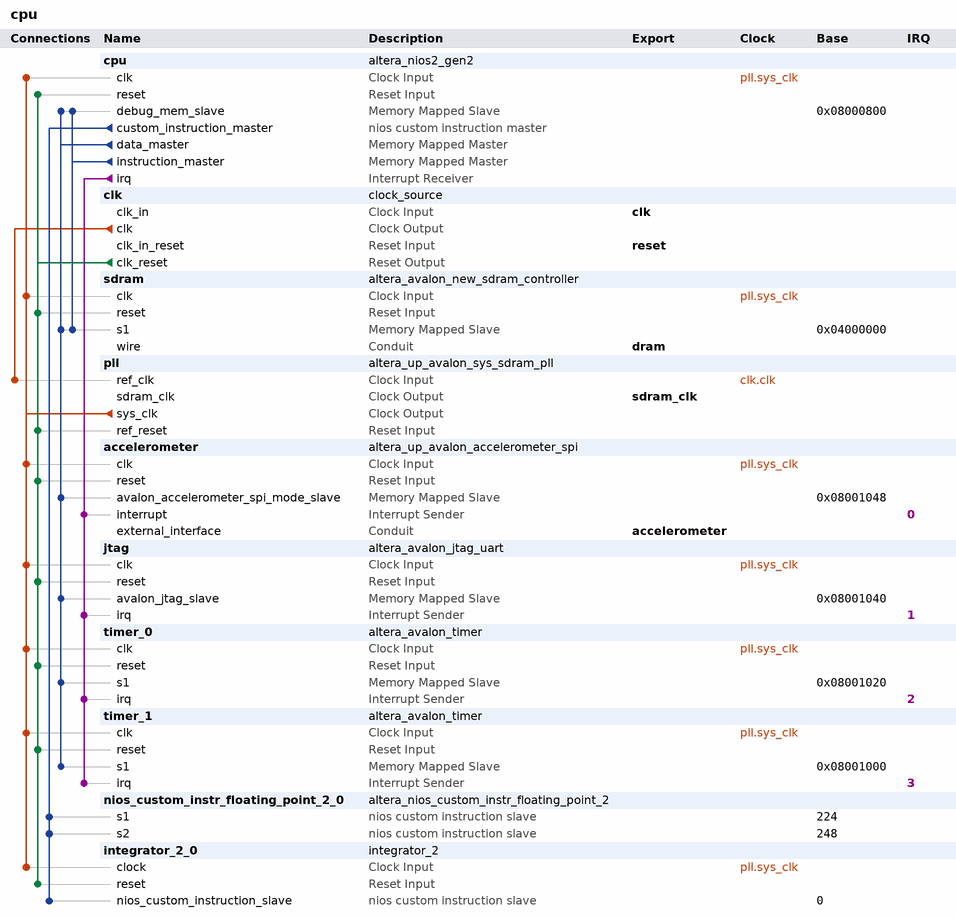
[diagram p0: system contents]
# Platform Designer (Qsys) system cpu, MAX 10 10M50DAF484C7G
# Parameters at their usual value, and those the tool derives, are not listed.
package require -exact qsys 20.1
create_system cpu
set_project_property DEVICE_FAMILY {MAX 10}
set_project_property DEVICE 10M50DAF484C7G

add_instance cpu altera_nios2_gen2 20.1
set_instance_parameter_value cpu dcache_size 2048
set_instance_parameter_value cpu exceptionSlave sdram.s1
set_instance_parameter_value cpu icache_size 4096
set_instance_parameter_value cpu impl Tiny
set_instance_parameter_value cpu resetSlave sdram.s1

add_instance clk clock_source 20.1
set_instance_parameter_value clk clockFrequency 50000000

add_instance sdram altera_avalon_new_sdram_controller 20.1
set_instance_parameter_value sdram TAC 5.5
set_instance_parameter_value sdram TRCD 20.0
set_instance_parameter_value sdram TRP 20.0
set_instance_parameter_value sdram casLatency 3
set_instance_parameter_value sdram columnWidth 10
set_instance_parameter_value sdram dataWidth 16
set_instance_parameter_value sdram generateSimulationModel false
set_instance_parameter_value sdram model single_Micron_MT48LC4M32B2_7_chip
set_instance_parameter_value sdram numberOfBanks 4
set_instance_parameter_value sdram numberOfChipSelects 1
set_instance_parameter_value sdram powerUpDelay 100.0
set_instance_parameter_value sdram refreshPeriod 15.625
set_instance_parameter_value sdram rowWidth 13

add_instance pll altera_up_avalon_sys_sdram_pll 18.0
set_instance_parameter_value pll CV_boards DE10-Standard
set_instance_parameter_value pll gui_outclk 50.0
set_instance_parameter_value pll gui_refclk 50.0

add_instance accelerometer altera_up_avalon_accelerometer_spi 18.0

add_instance jtag altera_avalon_jtag_uart 20.1
set_instance_parameter_value jtag simInteractiveOptions NO_INTERACTIVE_WINDOWS

add_instance timer_0 altera_avalon_timer 20.1
set_instance_parameter_value timer_0 period 1
set_instance_parameter_value timer_0 periodUnits MSEC

add_instance timer_1 altera_avalon_timer 20.1
set_instance_parameter_value timer_1 period 1
set_instance_parameter_value timer_1 periodUnits MSEC

add_instance nios_custom_instr_floating_point_2_0 altera_nios_custom_instr_floating_point_2 20.1
set_instance_parameter_value nios_custom_instr_floating_point_2_0 arithmetic_present true
set_instance_parameter_value nios_custom_instr_floating_point_2_0 comparison_present true
set_instance_parameter_value nios_custom_instr_floating_point_2_0 conversion_present true
set_instance_parameter_value nios_custom_instr_floating_point_2_0 root_present false

add_instance integrator_2_0 integrator_2 2.0

# connections
add_connection clk.clk pll.ref_clk clock
add_connection pll.sys_clk accelerometer.clk clock
add_connection pll.sys_clk cpu.clk clock
add_connection pll.sys_clk integrator_2_0.clock clock
add_connection pll.sys_clk jtag.clk clock
add_connection pll.sys_clk sdram.clk clock
add_connection pll.sys_clk timer_0.clk clock
add_connection pll.sys_clk timer_1.clk clock
add_connection clk.clk_reset accelerometer.reset reset
add_connection clk.clk_reset cpu.reset reset
add_connection clk.clk_reset integrator_2_0.reset reset
add_connection clk.clk_reset jtag.reset reset
add_connection clk.clk_reset pll.ref_reset reset
add_connection clk.clk_reset sdram.reset reset
add_connection clk.clk_reset timer_0.reset reset
add_connection clk.clk_reset timer_1.reset reset
add_connection cpu.data_master accelerometer.avalon_accelerometer_spi_mode_slave avalon
set_connection_parameter_value cpu.data_master/accelerometer.avalon_accelerometer_spi_mode_slave baseAddress 0x08001048
add_connection cpu.data_master cpu.debug_mem_slave avalon
set_connection_parameter_value cpu.data_master/cpu.debug_mem_slave baseAddress 0x08000800
add_connection cpu.data_master jtag.avalon_jtag_slave avalon
set_connection_parameter_value cpu.data_master/jtag.avalon_jtag_slave baseAddress 0x08001040
add_connection cpu.data_master sdram.s1 avalon
set_connection_parameter_value cpu.data_master/sdram.s1 baseAddress 0x04000000
add_connection cpu.data_master timer_0.s1 avalon
set_connection_parameter_value cpu.data_master/timer_0.s1 baseAddress 0x08001020
add_connection cpu.data_master timer_1.s1 avalon
set_connection_parameter_value cpu.data_master/timer_1.s1 baseAddress 0x08001000
add_connection cpu.instruction_master cpu.debug_mem_slave avalon
set_connection_parameter_value cpu.instruction_master/cpu.debug_mem_slave baseAddress 0x08000800
add_connection cpu.instruction_master sdram.s1 avalon
set_connection_parameter_value cpu.instruction_master/sdram.s1 baseAddress 0x04000000
add_connection cpu.irq accelerometer.interrupt interrupt
set_connection_parameter_value cpu.irq/accelerometer.interrupt irqNumber 0
add_connection cpu.irq jtag.irq interrupt
set_connection_parameter_value cpu.irq/jtag.irq irqNumber 1
add_connection cpu.irq timer_0.irq interrupt
set_connection_parameter_value cpu.irq/timer_0.irq irqNumber 2
add_connection cpu.irq timer_1.irq interrupt
set_connection_parameter_value cpu.irq/timer_1.irq irqNumber 3
add_connection cpu.custom_instruction_master integrator_2_0.nios_custom_instruction_slave nios_custom_instruction
set_connection_parameter_value cpu.custom_instruction_master/integrator_2_0.nios_custom_instruction_slave CIName integrator_2_0
set_connection_parameter_value cpu.custom_instruction_master/integrator_2_0.nios_custom_instruction_slave baseAddress 0
add_connection cpu.custom_instruction_master nios_custom_instr_floating_point_2_0.s1 nios_custom_instruction
set_connection_parameter_value cpu.custom_instruction_master/nios_custom_instr_floating_point_2_0.s1 CIName nios_custom_instr_floating_point_2_0
set_connection_parameter_value cpu.custom_instruction_master/nios_custom_instr_floating_point_2_0.s1 baseAddress 224
add_connection cpu.custom_instruction_master nios_custom_instr_floating_point_2_0.s2 nios_custom_instruction
set_connection_parameter_value cpu.custom_instruction_master/nios_custom_instr_floating_point_2_0.s2 CIName nios_custom_instr_floating_point_2_0_1
set_connection_parameter_value cpu.custom_instruction_master/nios_custom_instr_floating_point_2_0.s2 baseAddress 248

# exported interfaces
add_interface accelerometer conduit end
set_interface_property accelerometer EXPORT_OF accelerometer.external_interface
add_interface clk clock sink
set_interface_property clk EXPORT_OF clk.clk_in
add_interface dram conduit end
set_interface_property dram EXPORT_OF sdram.wire
add_interface reset reset sink
set_interface_property reset EXPORT_OF clk.clk_in_reset
add_interface sdram_clk clock source
set_interface_property sdram_clk EXPORT_OF pll.sdram_clk

set_interconnect_requirement {$system} qsys_mm.clockCrossingAdapter HANDSHAKE
set_interconnect_requirement {$system} qsys_mm.enableEccProtection FALSE
set_interconnect_requirement {$system} qsys_mm.insertDefaultSlave FALSE
set_interconnect_requirement {$system} qsys_mm.maxAdditionalLatency 1

save_system cpu.qsys
